# Altium project TourniquetPCBV1.PrjPcb (part 2 of 3)
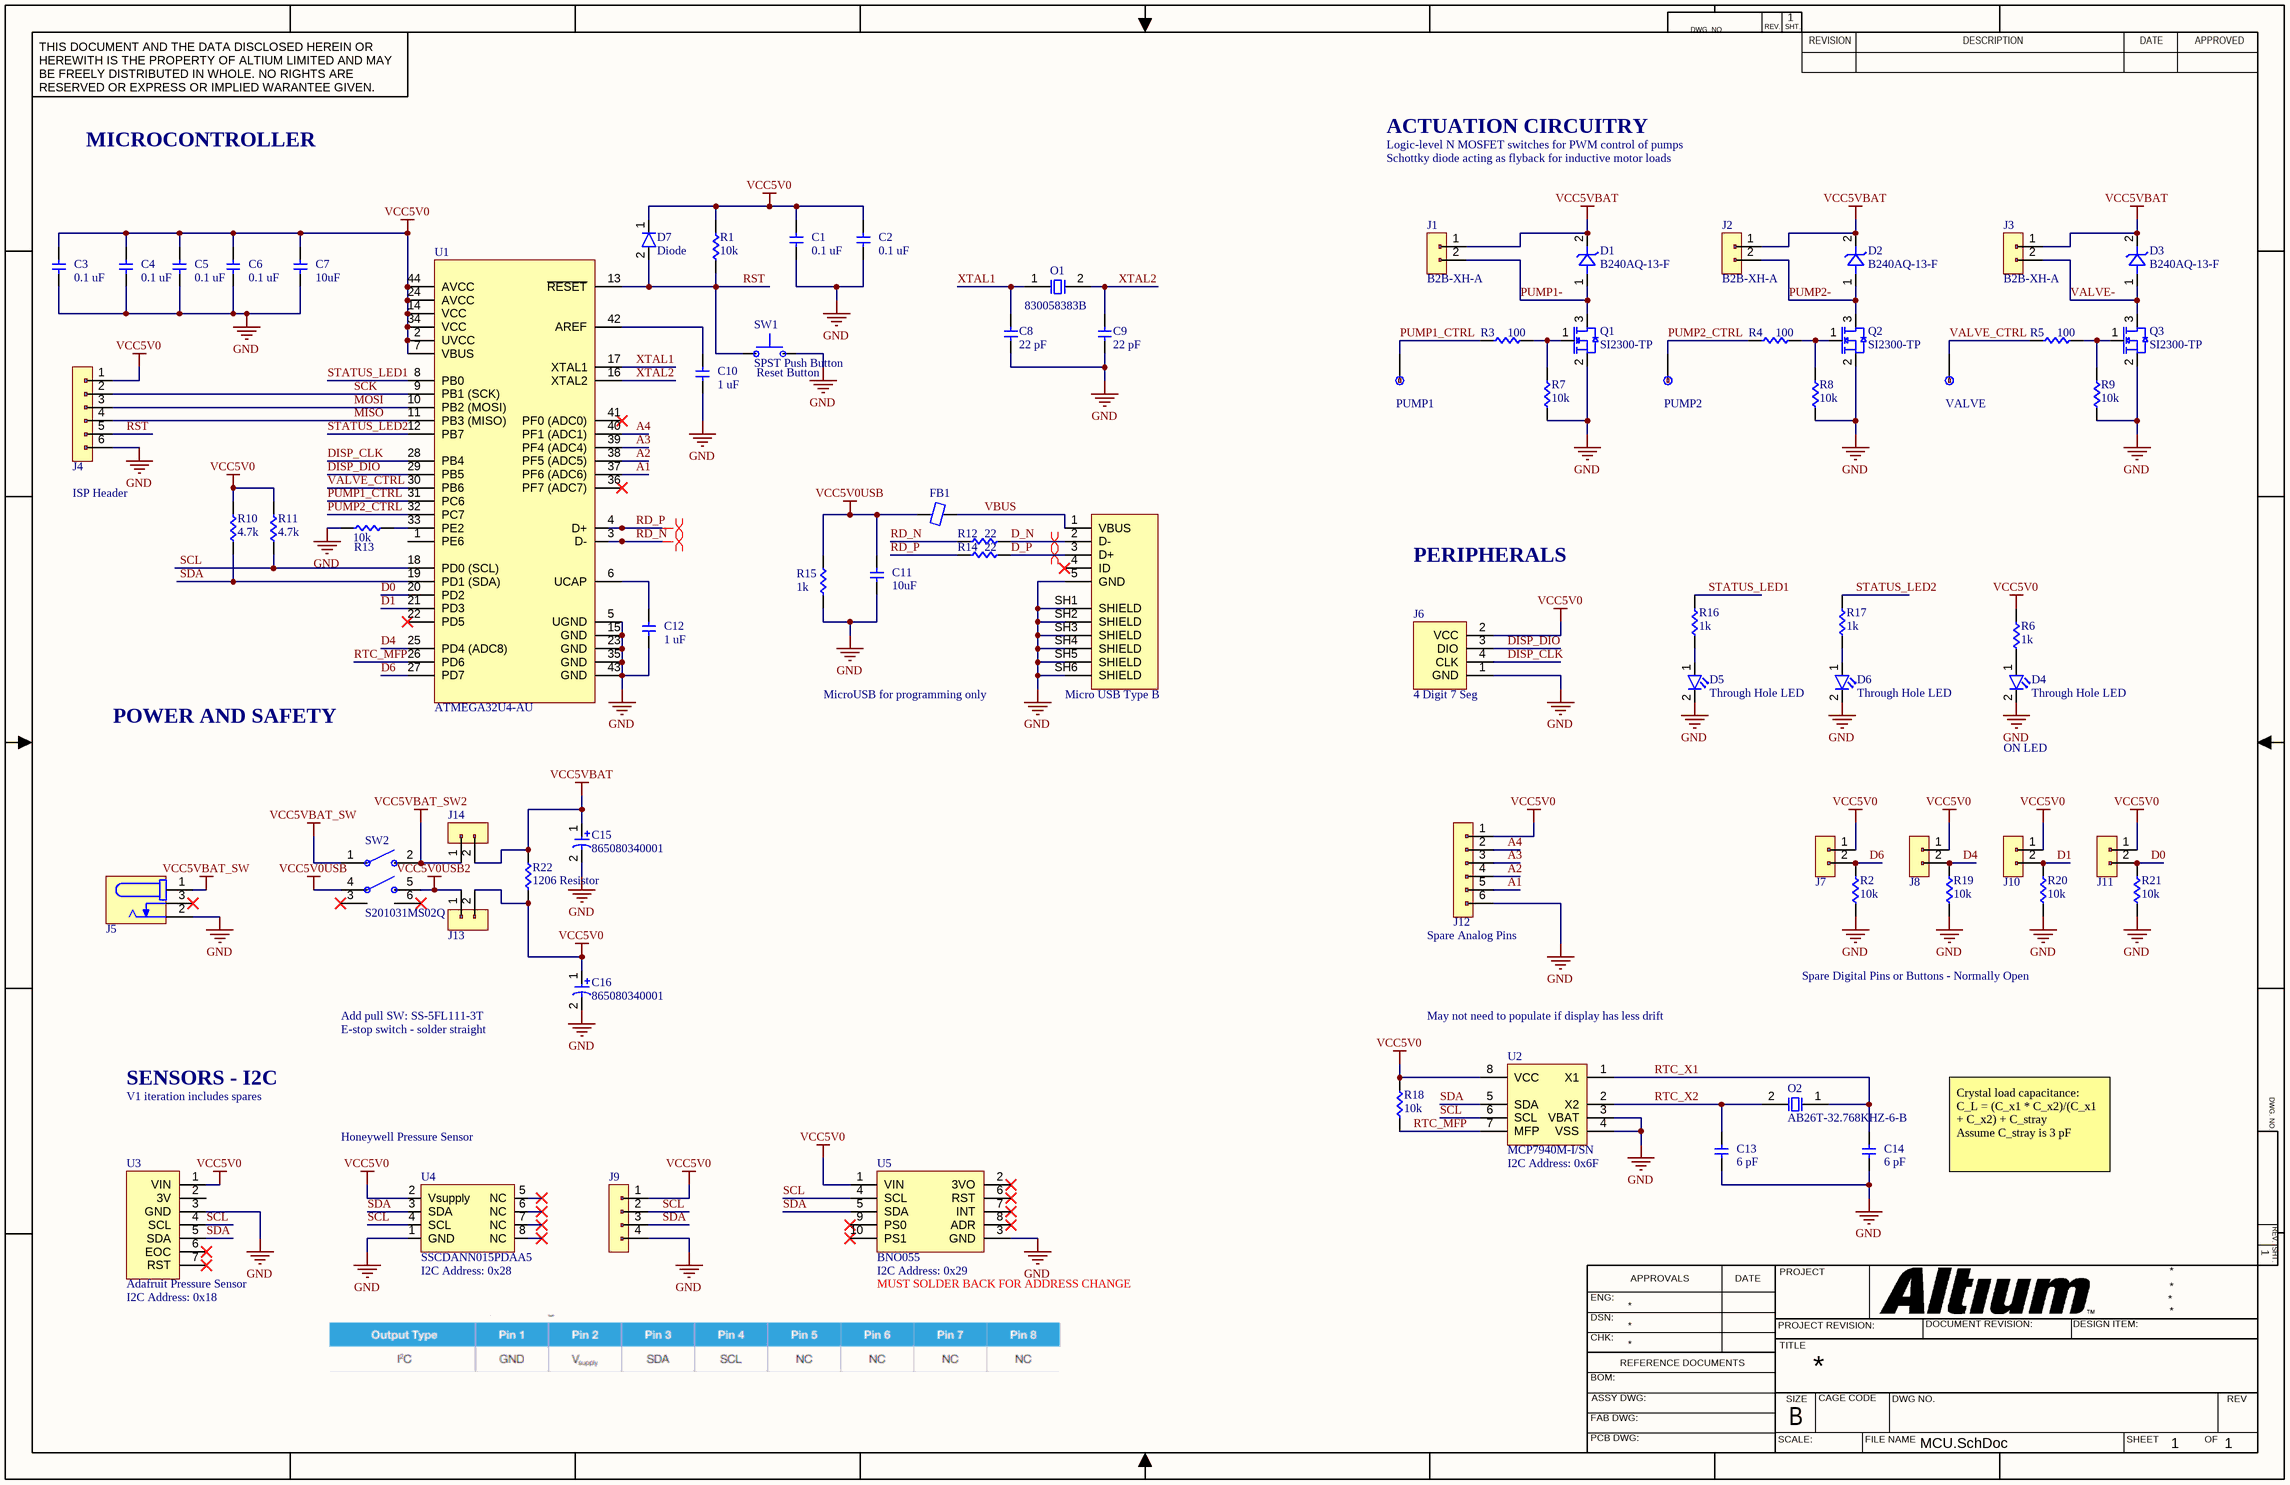
[diagram p1: MCU.SchDoc]

## Sheet MCU.SchDoc (continued)
### Library data of the parts
* = Micro USB Type B: 10118194-0001LF; Manufacturer: Molex; Manufacturer Part Number: 105164-0001; Manufacturer Lifecycle Status: ACTIVE; Current Rating: 1.8A; Dielectric Material: Liquid Crystal Polymer; Gender: Female; Max Voltage Rating (AC): 30V; Number of Circuits: 5; Number of Ports: 1; Pitch: 650µm; Plating: Gold; USB Standard: USB 2.0; Supplier: Avnet; Supplier Part Number: 1051640001; RoHS: Compliant; Category: USB Connectors; Stock: 9100; Pricing: 1300=0.47412, 16900=0.40682, 40300=0.38931, 80600=0.36143, 200200=0.329 (USD); China RoHS: Compliant; Color: Black; Connector Type: USB; Contact Gender: Female; Contact Material: Brass; Contact Plating: Gold; Country of Origin: US; Depth: 5.15mm; Flammability Rating: UL94 V-0; Halogen Free: Low Halogen; Height: 2.715mm; Housing Material: Polymer; Length: 7.5mm; Lifecycle Status: Production; Max Operating Temperature: 85°C; Min Operating Temperature: -30°C; Mounting Technology: Horizontal, Surface Mount; Number of Contacts: 5; Pins: 5; Number of Rows: 1; Number of Terminals: 5; Orientation: Right Angle; Radiation Hardening: No; REACH SVHC: Yes; Schedule B: 8536695050; Shell Material: Stainless Steel; Termination: Solder; Voltage Rating: 30V; Voltage Rating (AC): 30V; ComponentLink1URL: https://datasheet.octopart.com:443/105164-0001-Molex-datasheet-138896958.pdf?src-supplier=Upverter; ComponentLink1Description: https://datasheet.octopart.com:443/105164-0001-Molex-datasheet-138896958.pdf?src-supplier=Upverter; ComponentLink2URL: https://sigma.octopart.com:443/138896959/technical_drawing/Molex-105164-0001.pdf?src-supplier=Upverter; ComponentLink2Description: https://sigma.octopart.com:443/138896959/technical_drawing/Molex-105164-0001.pdf?src-supplier=Upverter; ComponentLink3URL: https://datasheet.octopart.com:443/105164-0001-Molex-datasheet-16324421.pdf?src-supplier=Sager+Electronics; ComponentLink3Description: https://datasheet.octopart.com:443/105164-0001-Molex-datasheet-16324421.pdf?src-supplier=Sager+Electronics; ComponentLink4URL: https://sigma.octopart.com:443/16324424/technical_drawing/Molex-105164-0001.pdf?src-supplier=Molex; ComponentLink4Description: https://sigma.octopart.com:443/16324424/technical_drawing/Molex-105164-0001.pdf?src-supplier=Molex; ComponentLink5URL: https://datasheet.octopart.com:443/105164-0001-Molex-datasheet-66419585.pdf?src-supplier=element14+APAC; ComponentLink5Description: https://datasheet.octopart.com:443/105164-0001-Molex-datasheet-66419585.pdf?src-supplier=element14+APAC; ComponentLink6URL: https://datasheet.octopart.com:443/105164-0001-Molex-datasheet-140174757.pdf?src-supplier=RS+(Formerly+Allied+Electronics); ComponentLink6Description: https://datasheet.octopart.com:443/105164-0001-Molex-datasheet-140174757.pdf?src-supplier=RS+(Formerly+Allied+Electronics); ComponentLink7URL: https://datasheet.octopart.com:443/105164-0001-Molex-datasheet-120135208.pdf?src-supplier=RS+(Formerly+Allied+Electronics); ComponentLink7Description: https://datasheet.octopart.com:443/105164-0001-Molex-datasheet-120135208.pdf?src-supplier=RS+(Formerly+Allied+Electronics); ComponentLink8URL: https://datasheet.octopart.com:443/105164-0001-Molex-datasheet-120074113.pdf?src-supplier=TME; ComponentLink8Description: https://datasheet.octopart.com:443/105164-0001-Molex-datasheet-120074113.pdf?src-supplier=TME; ComponentLink9URL: https://datasheet.octopart.com:443/105164-0001-Molex-datasheet-13747870.pdf?src-supplier=_legacy+Avnet; ComponentLink9Description: https://datasheet.octopart.com:443/105164-0001-Molex-datasheet-13747870.pdf?src-supplier=_legacy+Avnet; ComponentLink10URL: http://sigma.octopart.com:80/16324423/rohs_statement/Molex-105164-0001.pdf?src-supplier=Compliance+Statements; ComponentLink10Description: http://sigma.octopart.com:80/16324423/rohs_statement/Molex-105164-0001.pdf?src-supplier=Compliance+Statements; ComponentLink11URL: http://sigma.octopart.com:80/reach_statement/Molex-company-74.pdf?src-supplier=Compliance+Statements; ComponentLink11Description: http://sigma.octopart.com:80/reach_statement/Molex-company-74.pdf?src-supplier=Compliance+Statements; ComponentLink12URL: http://sigma.octopart.com:80/rohs_statement/Molex-company-73.pdf?src-supplier=Compliance+Statements; ComponentLink12Description: http://sigma.octopart.com:80/rohs_statement/Molex-company-73.pdf?src-supplier=Compliance+Statements; ComponentLink13URL: http://sigma.octopart.com:80/conflict_mineral_statement/Molex-company-72.pdf?src-supplier=Compliance+Statements; ComponentLink13Description: http://sigma.octopart.com:80/conflict_mineral_statement/Molex-company-72.pdf?src-supplier=Compliance+Statements
C1-C14 = CAPACITOR: 16V 100nF X7R ±10% 0603 Multilayer Ceramic Capacitors MLCC - SMD/SMT ROHS; Manufacturer: Yageo Group; Manufacturer Part Number: CC0603KRX7R7BB104; Insulation Resistance: 100GΩ; Supplier: Avnet; Supplier Part Number: CC0603KRX7R7BB104; RoHS: Compliant; Category: Ceramic Capacitors; Stock: 1252000; Pricing: 4000=0.00582, 8000=0.00559, 16000=0.00541, 32000=0.00522, 64000=0.00504 (USD); Value: 100nF; Case/Package: 0603; Case Code (Imperial): 0603; Case Code (Metric): 1608; China RoHS: Compliant; Composition: Ceramic; Depth: 800µm; Dielectric: X7R; Dielectric Material: Ceramic; Halogen Free: Halogen Free; Height: 800µm; Lead Free: Lead Free; Length: 1.6mm; Lifecycle Status: Production; Material: Ceramic; Max Operating Temperature: 125°C; Min Operating Temperature: -55°C; Mounting Technology: Surface Mount; Pins: 2; Number of Terminals: 2; Radiation Hardening: No; REACH SVHC: Yes; Schedule B: 8532240020, 8532240020|8532240020, 8532240020|8532240020|8532240020, 8532240020|8532240020|8532240020|8532240020; Termination: SMD/SMT; Thickness: 889µm; Tolerance: 10%; Voltage: 16V; Voltage Rating: 16V; Voltage Rating (DC): 16V; Width: 800µm; ComponentLink1URL: https://datasheet.octopart.com:443/CC0603KRX7R7BB104-Yageo-datasheet-177165144.pdf?src-supplier=IHS; ComponentLink1Description: https://datasheet.octopart.com:443/CC0603KRX7R7BB104-Yageo-datasheet-177165144.pdf?src-supplier=IHS; ComponentLink2URL: https://datasheet.octopart.com:443/CC0603KRX7R7BB104-Yageo-datasheet-82288757.pdf?src-supplier=Upverter; ComponentLink2Description: https://datasheet.octopart.com:443/CC0603KRX7R7BB104-Yageo-datasheet-82288757.pdf?src-supplier=Upverter; ComponentLink3URL: https://datasheet.octopart.com/CC0603KRX7R7BB104-Yageo-datasheet-10883670.pdf; ComponentLink3Description: https://datasheet.octopart.com/CC0603KRX7R7BB104-Yageo-datasheet-10883670.pdf; ComponentLink4URL: https://datasheet.octopart.com:443/CC0603KRX7R7BB104-Yageo-datasheet-181968638.pdf?src-supplier=Newark; ComponentLink4Description: https://datasheet.octopart.com:443/CC0603KRX7R7BB104-Yageo-datasheet-181968638.pdf?src-supplier=Newark; ComponentLink5URL: https://datasheet.octopart.com:443/CC0603KRX7R7BB104-Phycomp-datasheet-499490.pdf?src-supplier=Newark; ComponentLink5Description: https://datasheet.octopart.com:443/CC0603KRX7R7BB104-Phycomp-datasheet-499490.pdf?src-supplier=Newark; ComponentLink6URL: https://datasheet.octopart.com:443/CC0603KRX7R7BB104-Yageo-datasheet-62336348.pdf?src-supplier=Newark; ComponentLink6Description: https://datasheet.octopart.com:443/CC0603KRX7R7BB104-Yageo-datasheet-62336348.pdf?src-supplier=Newark; ComponentLink7URL: https://datasheet.octopart.com:443/CC0603KRX7R7BB104-Yageo-datasheet-15895757.pdf?src-supplier=Newark; ComponentLink7Description: https://datasheet.octopart.com:443/CC0603KRX7R7BB104-Yageo-datasheet-15895757.pdf?src-supplier=Newark; ComponentLink8URL: https://datasheet.octopart.com:443/CC0603KRX7R7BB104-Yageo-datasheet-182050803.pdf?src-supplier=Newark; ComponentLink8Description: https://datasheet.octopart.com:443/CC0603KRX7R7BB104-Yageo-datasheet-182050803.pdf?src-supplier=Newark; ComponentLink9URL: https://datasheet.octopart.com:443/CC0603KRX7R7BB104-Yageo-datasheet-151948686.pdf?src-supplier=Farnell; ComponentLink9Description: https://datasheet.octopart.com:443/CC0603KRX7R7BB104-Yageo-datasheet-151948686.pdf?src-supplier=Farnell; ComponentLink10URL: https://datasheet.octopart.com:443/CC0603KRX7R7BB104-Phycomp-datasheet-500777.pdf?src-supplier=Farnell; ComponentLink10Description: https://datasheet.octopart.com:443/CC0603KRX7R7BB104-Phycomp-datasheet-500777.pdf?src-supplier=Farnell; ComponentLink11URL: https://datasheet.octopart.com:443/CC0603KRX7R7BB104-Phycomp-datasheet-519481.pdf?src-supplier=element14; ComponentLink11Description: https://datasheet.octopart.com:443/CC0603KRX7R7BB104-Phycomp-datasheet-519481.pdf?src-supplier=element14; ComponentLink12URL: https://datasheet.octopart.com:443/CC0603KRX7R7BB104-Yageo-datasheet-8701427.pdf?src-supplier=element14; ComponentLink12Description: https://datasheet.octopart.com:443/CC0603KRX7R7BB104-Yageo-datasheet-8701427.pdf?src-supplier=element14; ComponentLink13URL: https://datasheet.octopart.com:443/CC0603KRX7R7BB104-Yageo-datasheet-5301394.pdf?src-supplier=element14; ComponentLink13Description: https://datasheet.octopart.com:443/CC0603KRX7R7BB104-Yageo-datasheet-5301394.pdf?src-supplier=element14; ComponentLink14URL: https://datasheet.octopart.com:443/CC0603KRX7R7BB104-Yageo-datasheet-166511530.pdf?src-supplier=Future+Electronics; ComponentLink14Description: https://datasheet.octopart.com:443/CC0603KRX7R7BB104-Yageo-datasheet-166511530.pdf?src-supplier=Future+Electronics; ComponentLink15URL: https://datasheet.octopart.com:443/CC0603KRX7R7BB104-Yageo-datasheet-137700082.pdf?src-supplier=Future+Electronics; ComponentLink15Description: https://datasheet.octopart.com:443/CC0603KRX7R7BB104-Yageo-datasheet-137700082.pdf?src-supplier=Future+Electronics; ComponentLink16URL: https://datasheet.octopart.com:443/CC0603KRX7R7BB104-Yageo-datasheet-137700084.pdf?src-supplier=Future+Electronics; ComponentLink16Description: https://datasheet.octopart.com:443/CC0603KRX7R7BB104-Yageo-datasheet-137700084.pdf?src-supplier=Future+Electronics; ComponentLink17URL: https://datasheet.octopart.com:443/CC0603KRX7R7BB104-Yageo-datasheet-27626582.pdf?src-supplier=Future+Electronics; ComponentLink17Description: https://datasheet.octopart.com:443/CC0603KRX7R7BB104-Yageo-datasheet-27626582.pdf?src-supplier=Future+Electronics; ComponentLink18URL: https://datasheet.octopart.com:443/CC0603KRX7R7BB104-Yageo-datasheet-12526321.pdf?src-supplier=Future+Electronics; ComponentLink18Description: https://datasheet.octopart.com:443/CC0603KRX7R7BB104-Yageo-datasheet-12526321.pdf?src-supplier=Future+Electronics; ComponentLink19URL: https://datasheet.octopart.com:443/CC0603KRX7R7BB104-Yageo-datasheet-10911834.pdf?src-supplier=Future+Electronics; ComponentLink19Description: https://datasheet.octopart.com:443/CC0603KRX7R7BB104-Yageo-datasheet-10911834.pdf?src-supplier=Future+Electronics; ComponentLink20URL: https://datasheet.octopart.com:443/CC0603KRX7R7BB104-Yageo-datasheet-8324442.pdf?src-supplier=Future+Electronics; ComponentLink20Description: https://datasheet.octopart.com:443/CC0603KRX7R7BB104-Yageo-datasheet-8324442.pdf?src-supplier=Future+Electronics; ComponentLink21URL: https://datasheet.octopart.com:443/CC0603KRX7R7BB104-Yageo-Group-datasheet-165992755.pdf?src-supplier=ODG+(Origin+Data+Global); ComponentLink21Description: https://datasheet.octopart.com:443/CC0603KRX7R7BB104-Yageo-Group-datasheet-165992755.pdf?src-supplier=ODG+(Origin+Data+Global); ComponentLink22URL: https://datasheet.octopart.com:443/CC0603KRX7R7BB104-Yageo-datasheet-140260305.pdf?src-supplier=SOS+electronic; ComponentLink22Description: https://datasheet.octopart.com:443/CC0603KRX7R7BB104-Yageo-datasheet-140260305.pdf?src-supplier=SOS+electronic; ComponentLink23URL: https://datasheet.octopart.com:443/CC0603KRX7R7BB104-Yageo-datasheet-178018956.pdf?src-supplier=Burklin+Elektronik; ComponentLink23Description: https://datasheet.octopart.com:443/CC0603KRX7R7BB104-Yageo-datasheet-178018956.pdf?src-supplier=Burklin+Elektronik; ComponentLink24URL: https://datasheet.octopart.com:443/CC0603KRX7R7BB104-Yageo-datasheet-17600895.pdf?src-supplier=TME; ComponentLink24Description: https://datasheet.octopart.com:443/CC0603KRX7R7BB104-Yageo-datasheet-17600895.pdf?src-supplier=TME; ComponentLink25URL: https://datasheet.octopart.com:443/CC0603KRX7R7BB104-Yageo-datasheet-118396.pdf?src-supplier=DigiKey; ComponentLink25Description: https://datasheet.octopart.com:443/CC0603KRX7R7BB104-Yageo-datasheet-118396.pdf?src-supplier=DigiKey; ComponentLink26URL: http://sigma.octopart.com:80/conflict_mineral_statement/Yageo-company-3.pdf?src-supplier=Compliance+Statements; ComponentLink26Description: http://sigma.octopart.com:80/conflict_mineral_statement/Yageo-company-3.pdf?src-supplier=Compliance+Statements; ComponentLink27URL: http://sigma.octopart.com:80/rohs_statement/Yageo-company-2.pdf?src-supplier=Compliance+Statements; ComponentLink27Description: http://sigma.octopart.com:80/rohs_statement/Yageo-company-2.pdf?src-supplier=Compliance+Statements
C15 C16 = CAP_POLARIZED: 10 µF 16 V Aluminum Electrolytic Capacitors Radial, Can - SMD 2000 Hrs @ 105°C; Manufacturer: Wurth; Manufacturer Part Number: 0878310641; Number of Positions: 6; Current Rating: 2A; Voltage Rating: 125V; Gender: Male; Reviewed: No; Part Number: 865080340001; Series: Milli-Grid 87831; Mount: Through Hole; Number of Rows: 2; Fastening Type: Latch Holder; Orientation: Vertical; Min Operating Temperature: -55°C; Max Operating Temperature: 105°C; Supplier 1: Digi-Key; Supplier Part Number 1: WM3590-ND; ComponentLink1URL: https://tools.molex.com/pdm_docs/ps/PS-87831-027.pdf; ComponentLink1Description: Datasheet
D1-D3 = SCHOTTKY: Manufacturer: Diodes Incorporated; Current Rating: 2A; Voltage Rating: 40; Reviewed: No; Part Number: B240AQ-13-F; Manufacturer Part Number: B240AQ-13-F; Series: -; Mount: Surface; Supplier Part Number 1: WM3590-ND; ComponentLink1URL: https://tools.molex.com/pdm_docs/ps/PS-87831-027.pdf; ComponentLink1Description: Datasheet
D4-D6 = LED RED DIFFUSED 5MM ROUND T/H: Red 645nm LED Indication - Discrete 2.1V Radial; Manufacturer: Wurth Elektronik; Manufacturer Part Number: 151051RS11000; Forward Current: 100mA; Lens Size: 5mm; Lens Style: Circular, Diffused, Round; Luminous Intensity: 30mcd; Max Reverse Voltage (DC): 5V; Peak Wavelength: 650nm; Test Current: 20mA; Viewing Angle: 60°; Wavelength: 630nm; Supplier: Newark; Supplier Part Number: 151051RS11000; RoHS: Compliant; Category: LEDs; Stock: 1883; Pricing: 5=0.269, 10=0.262, 25=0.255, 50=0.248, 100=0.217, 500=0.201 (CAD); Case/Package: Radial; Color: Red; Dominant Wavelength: 645nm; Forward Voltage: 2.1V; Height: 8.6mm; Length: 5mm; Max Operating Temperature: 85°C; Min Operating Temperature: -40°C; Mounting Technology: Through Hole; Packaging: Bulk; REACH SVHC: Unknown; Width: 5mm; ComponentLink1URL: https://datasheet.octopart.com:443/151051RS11000-Wurth-Elektronik-datasheet-168474692.pdf?src-supplier=Wurth+Elektronik; ComponentLink1Description: https://datasheet.octopart.com:443/151051RS11000-Wurth-Elektronik-datasheet-168474692.pdf?src-supplier=Wurth+Elektronik; ComponentLink2URL: https://datasheet.octopart.com:443/151051RS11000-W%C3%BCrth-Elektronik-datasheet-83005830.pdf?src-supplier=Future+Electronics; ComponentLink2Description: https://datasheet.octopart.com:443/151051RS11000-W%C3%BCrth-Elektronik-datasheet-83005830.pdf?src-supplier=Future+Electronics; ComponentLink3URL: https://datasheet.octopart.com:443/151051RS11000-W%C3%BCrth-Elektronik-datasheet-15983824.pdf?src-supplier=element14+APAC; ComponentLink3Description: https://datasheet.octopart.com:443/151051RS11000-W%C3%BCrth-Elektronik-datasheet-15983824.pdf?src-supplier=element14+APAC
D7 = Diode: Diode 100 V 150mA Surface Mount SOD-123; Manufacturer: onsemi; Manufacturer Part Number: 1N4148WS; Manufacturer Lifecycle Status: ACTIVE; Value: 4pF; Element Configuration: Single; Forward Voltage: 1V; Max Forward Surge Current (Ifsm): 4A; Max Junction Temperature (Tj): 150°C; Max Power Dissipation: 200mW; Max Repetitive Reverse Voltage (Vrrm): 75V; Number of Elements: 1; Peak Reverse Current: 5µA; Recovery Time: 4ns; Supplier: Avnet; Supplier Part Number: 1N4148WS; RoHS: Compliant; Category: Rectifier Diodes; Stock: 171000; Pricing: 3000=0.01888, 6000=0.01822, 12000=0.01795, 24000=0.01769, 48000=0.01742 (USD); Average Rectified Current: 150mA; China RoHS: Compliant; Contact Plating: Tin; Forward Current: 150mA; Height: 900µm; Lead Free: Lead Free; Length: 1.8mm; Lifecycle Status: Production; Max Operating Temperature: 150°C; Max Output current: 150mA; Max Reverse Voltage (DC): 75V; Min Operating Temperature: -55°C; Mounting Technology: Surface Mount; Pins: 2; Number of Terminals: 2; Packaging: Cut Tape; Power Dissipation: 200mW; Radiation Hardening: No; REACH SVHC: Yes; Reverse Recovery Time: 4ns; Reverse Standoff Voltage: 75V; Reverse Voltage: 75V; Schedule B: 8541100070, 8541100070|8541100070|8541100070|8541100070|8541100070|8541100070|8541100070|8541100070|8541100070|8541100070|8541100070|8541100070|8541100070|8541100070|8541100070|8541100070|8541100070|8541100070|8541100070|8541100070|8541100070|8541100070|8541100070|85; Weight: 27.6mg; Width: 1.35mm; ComponentLink1URL: https://datasheet.octopart.com:443/1N4148WS-ON-Semiconductor-datasheet-154551630.pdf?src-supplier=Farnell; ComponentLink1Description: https://datasheet.octopart.com:443/1N4148WS-ON-Semiconductor-datasheet-154551630.pdf?src-supplier=Farnell; ComponentLink2URL: https://datasheet.octopart.com:443/1N4148WS-Fairchild-Semiconductor-datasheet-67878664.pdf?src-supplier=Farnell; ComponentLink2Description: https://datasheet.octopart.com:443/1N4148WS-Fairchild-Semiconductor-datasheet-67878664.pdf?src-supplier=Farnell; ComponentLink3URL: https://datasheet.octopart.com:443/1N4148WS-Fairchild-Semiconductor-datasheet-68650011.pdf?src-supplier=Farnell; ComponentLink3Description: https://datasheet.octopart.com:443/1N4148WS-Fairchild-Semiconductor-datasheet-68650011.pdf?src-supplier=Farnell; ComponentLink4URL: https://datasheet.octopart.com:443/1N4148WS-ON-Semiconductor-datasheet-11741836.pdf?src-supplier=Upverter; ComponentLink4Description: https://datasheet.octopart.com:443/1N4148WS-ON-Semiconductor-datasheet-11741836.pdf?src-supplier=Upverter; ComponentLink5URL: https://datasheet.octopart.com:443/1N4148WS-ON-Semiconductor-datasheet-137236190.pdf?src-supplier=Upverter; ComponentLink5Description: https://datasheet.octopart.com:443/1N4148WS-ON-Semiconductor-datasheet-137236190.pdf?src-supplier=Upverter; ComponentLink6URL: https://sigma.octopart.com:443/138895951/technical_drawing/ON-Semiconductor-1N4148WS.pdf?src-supplier=Upverter; ComponentLink6Description: https://sigma.octopart.com:443/138895951/technical_drawing/ON-Semiconductor-1N4148WS.pdf?src-supplier=Upverter; ComponentLink7URL: https://datasheet.octopart.com:443/1N4148WS-ON-Semiconductor-datasheet-41168538.pdf?src-supplier=IHS; ComponentLink7Description: https://datasheet.octopart.com:443/1N4148WS-ON-Semiconductor-datasheet-41168538.pdf?src-supplier=IHS; ComponentLink8URL: https://datasheet.octopart.com:443/1N4148WS-onsemi-datasheet-175423434.pdf?src-supplier=IHS; ComponentLink8Description: https://datasheet.octopart.com:443/1N4148WS-onsemi-datasheet-175423434.pdf?src-supplier=IHS; ComponentLink9URL: https://datasheet.octopart.com:443/1N4148WS-onsemi-datasheet-181265883.pdf?src-supplier=IHS; ComponentLink9Description: https://datasheet.octopart.com:443/1N4148WS-onsemi-datasheet-181265883.pdf?src-supplier=IHS; ComponentLink10URL: https://datasheet.octopart.com:443/1N4148WS-ON-Semiconductor-datasheet-85393213.pdf?src-supplier=onsemi; ComponentLink10Description: https://datasheet.octopart.com:443/1N4148WS-ON-Semiconductor-datasheet-85393213.pdf?src-supplier=onsemi; ComponentLink11URL: https://datasheet.octopart.com:443/1N4148WS-ON-Semiconductor-datasheet-86684483.pdf?src-supplier=onsemi; ComponentLink11Description: https://datasheet.octopart.com:443/1N4148WS-ON-Semiconductor-datasheet-86684483.pdf?src-supplier=onsemi; ComponentLink12URL: https://datasheet.octopart.com:443/1N4148WS-ON-Semiconductor-datasheet-86681927.pdf?src-supplier=element14+APAC; ComponentLink12Description: https://datasheet.octopart.com:443/1N4148WS-ON-Semiconductor-datasheet-86681927.pdf?src-supplier=element14+APAC; ComponentLink13URL: https://datasheet.octopart.com:443/1N4148WS-Fairchild-datasheet-514620.pdf?src-supplier=Fairchild+Semiconductor; ComponentLink13Description: https://datasheet.octopart.com:443/1N4148WS-Fairchild-datasheet-514620.pdf?src-supplier=Fairchild+Semiconductor; ComponentLink14URL: https://sigma.octopart.com:443/17343424/technical_drawing/Fairchild-Semiconductor-1N4148WS.pdf?src-supplier=Fairchild+Semiconductor; ComponentLink14Description: https://sigma.octopart.com:443/17343424/technical_drawing/Fairchild-Semiconductor-1N4148WS.pdf?src-supplier=Fairchild+Semiconductor; ComponentLink15URL: https://datasheet.octopart.com:443/1N4148WS-Fairchild-Semiconductor-datasheet-14041777.pdf?src-supplier=iiiC; ComponentLink15Description: https://datasheet.octopart.com:443/1N4148WS-Fairchild-Semiconductor-datasheet-14041777.pdf?src-supplier=iiiC; ComponentLink16URL: https://datasheet.octopart.com:443/1N4148WS-Fairchild-Semiconductor-datasheet-67909704.pdf?src-supplier=Newark; ComponentLink16Description: https://datasheet.octopart.com:443/1N4148WS-Fairchild-Semiconductor-datasheet-67909704.pdf?src-supplier=Newark; ComponentLink17URL: https://datasheet.octopart.com:443/1N4148WS-Fairchild-Semiconductor-datasheet-68364970.pdf?src-supplier=Newark; ComponentLink17Description: https://datasheet.octopart.com:443/1N4148WS-Fairchild-Semiconductor-datasheet-68364970.pdf?src-supplier=Newark; ComponentLink18URL: http://sigma.octopart.com:80/150599222/rohs_statement/ON-Semiconductor-1N4148WS.pdf?src-supplier=Compliance+Statements; ComponentLink18Description: http://sigma.octopart.com:80/150599222/rohs_statement/ON-Semiconductor-1N4148WS.pdf?src-supplier=Compliance+Statements; ComponentLink19URL: http://sigma.octopart.com:80/17343422/reach_statement/Fairchild-Semiconductor-1N4148WS.pdf?src-supplier=Compliance+Statements; ComponentLink19Description: http://sigma.octopart.com:80/17343422/reach_statement/Fairchild-Semiconductor-1N4148WS.pdf?src-supplier=Compliance+Statements; ComponentLink20URL: http://sigma.octopart.com:80/17343423/materials_sheet/Fairchild-Semiconductor-1N4148WS.pdf?src-supplier=Compliance+Statements; ComponentLink20Description: http://sigma.octopart.com:80/17343423/materials_sheet/Fairchild-Semiconductor-1N4148WS.pdf?src-supplier=Compliance+Statements; ComponentLink21URL: http://sigma.octopart.com:80/33026183/reach_statement/Fairchild-Semiconductor-1N4148WS.pdf?src-supplier=Compliance+Statements; ComponentLink21Description: http://sigma.octopart.com:80/33026183/reach_statement/Fairchild-Semiconductor-1N4148WS.pdf?src-supplier=Compliance+Statements; ComponentLink22URL: http://sigma.octopart.com:80/33026185/materials_sheet/Fairchild-Semiconductor-1N4148WS.pdf?src-supplier=Compliance+Statements; ComponentLink22Description: http://sigma.octopart.com:80/33026185/materials_sheet/Fairchild-Semiconductor-1N4148WS.pdf?src-supplier=Compliance+Statements; ComponentLink23URL: http://sigma.octopart.com:80/reach_statement/ON-Semiconductor-company-79.pdf?src-supplier=Compliance+Statements; ComponentLink23Description: http://sigma.octopart.com:80/reach_statement/ON-Semiconductor-company-79.pdf?src-supplier=Compliance+Statements; ComponentLink24URL: http://sigma.octopart.com:80/rohs_statement/Fairchild-Semiconductor-company-11.pdf?src-supplier=Compliance+Statements; ComponentLink24Description: http://sigma.octopart.com:80/rohs_statement/Fairchild-Semiconductor-company-11.pdf?src-supplier=Compliance+Statements; ComponentLink25URL: http://sigma.octopart.com:80/rohs_statement/Fairchild-Semiconductor-company-10.pdf?src-supplier=Compliance+Statements; ComponentLink25Description: http://sigma.octopart.com:80/rohs_statement/Fairchild-Semiconductor-company-10.pdf?src-supplier=Compliance+Statements; ComponentLink26URL: http://sigma.octopart.com:80/reach_statement/Fairchild-Semiconductor-company-9.pdf?src-supplier=Compliance+Statements; ComponentLink26Description: http://sigma.octopart.com:80/reach_statement/Fairchild-Semiconductor-company-9.pdf?src-supplier=Compliance+Statements; ComponentLink27URL: https://octopart.com:443/opatz8j6/c1?t=uHNM4vEE5RF4Wag2R8kp6VlT4pqZhBeJnwFOwXCl1LdBIS0OfKt6iLU6zSwumjeV84ZoVx-BohKOdz8WxXol_lFRhccKbbirABoiNNEUOoiiHpLvrlnaqw6ivq0fNiOAwmbnwS_wu4a_bpVA6OlhtCLPYRSnKrIi2lsKLrM-59zupe5GdMDxNcDcvexuQu623eH8JwKLKAOtVvsRb9B5uh7SaBNx-mVh-99rNoWwC-t1ZI7kNy9N7MQnwsOnwV2wEnePMA_8VNOs7YOCSySFX_D5sQjssxvPaJMzGX3Fu5hAYAWH6C6RGVn2R7L8ham7Ii6Y7W0JBgvKChIBqfSyj4KKD9x85vg38LCZ&src-supplier=Compliance+Statements; ComponentLink27Description: https://octopart.com:443/opatz8j6/c1?t=uHNM4vEE5RF4Wag2R8kp6VlT4pqZhBeJnwFOwXCl1LdBIS0OfKt6iLU6zSwumjeV84ZoVx-BohKOdz8WxXol_lFRhccKbbirABoiNNEUOoiiHpLvrlnaqw6ivq0fNiOAwmbnwS_wu4a_bpVA6OlhtCLPYRSnKrIi2lsKLrM-59zupe5GdMDxNcDcvexuQu623eH8JwKLKAOtVvsRb9B5uh7SaBNx-mVh-99rNoWwC-t1ZI7kNy9N7MQnwsOnwV2wEnePMA_8VNOs7YOCSySFX_D5sQjssxvPaJMzGX3Fu5hAYAWH6C6RGVn2R7L8ham7Ii6Y7W0JBgvKChIBqfSyj4KKD9x85vg38LCZ&src-supplier=Compliance+Statements; ComponentLink28URL: https://octopart.com:443/opatz8j6/c1?t=JoVNp00jKFgAwlYcNpqrHNBvQdEgXnvd9TtzPlbpkuwn1q6IGg3foLc9dMjek33MGok0_F9d8-FklcBG_3-NN3HiNPj-kIq-kDcMbF-5G_YGsbIpjuyZJMIeAynYQr8ACdD7CYDv5pcWsenCztYc-VaJWKdxwlJUKaNsU8AAFB64gurg-TyIZkyutiLJlTN7a9uopgYHLR-wf0BKqemv6J5tGI6NWqyR1yTTVq2bu8gDDCjNmn8cXihQjkrKXmsKdX0UxqSCrQoxvuBozyVXOHg47yfoLsXgcrCe8i61tiXk82lhNmjIF86wLJ1dVeH3LjIwj5NhzpWWIrfWgcJvgwRxNIZIgYQ13nuGCQ&src-supplier=Compliance+Statements; ComponentLink28Description: https://octopart.com:443/opatz8j6/c1?t=JoVNp00jKFgAwlYcNpqrHNBvQdEgXnvd9TtzPlbpkuwn1q6IGg3foLc9dMjek33MGok0_F9d8-FklcBG_3-NN3HiNPj-kIq-kDcMbF-5G_YGsbIpjuyZJMIeAynYQr8ACdD7CYDv5pcWsenCztYc-VaJWKdxwlJUKaNsU8AAFB64gurg-TyIZkyutiLJlTN7a9uopgYHLR-wf0BKqemv6J5tGI6NWqyR1yTTVq2bu8gDDCjNmn8cXihQjkrKXmsKdX0UxqSCrQoxvuBozyVXOHg47yfoLsXgcrCe8i61tiXk82lhNmjIF86wLJ1dVeH3LjIwj5NhzpWWIrfWgcJvgwRxNIZIgYQ13nuGCQ&src-supplier=Compliance+Statements
FB1 = Ferrite Bead 732-1591-2-ND: 30 Ohms @ 100 MHz 1 Signal Line Ferrite Bead 0603 (1608 Metric) 3A 40mOhm; Manufacturer: KEMET; Manufacturer Part Number: C0805F104K4RACTU; Value: 100nF; Dielectric: X7R; Dielectric Material: Ceramic; Tolerance: 10%; Voltage Rating: 16V; Supplier: Newark; Supplier Part Number: C0805F104K4RACTU; RoHS: Compliant; Category: Ceramic Capacitors; Stock: 2981; Pricing: 10=0.244 (CAD); Case/Package: 0805; Case Code (Imperial): 0805; Case Code (Metric): 2012; China RoHS: Compliant; Features: Soft Termination; Height: 1.25mm; Length: 2mm; Lifecycle Status: Production; Max Operating Temperature: 125°C; Min Operating Temperature: -55°C; Mounting Technology: Surface Mount; Number of Terminals: 2; REACH SVHC: Yes; Termination: SMD/SMT; Thickness: 1.397mm; Voltage Rating (DC): 16V; Weight: 5.499807mg; Width: 1.25mm; ComponentLink1URL: https://datasheet.octopart.com:443/C0805F104K4RACTU-KEMET-datasheet-178087927.pdf?src-supplier=IHS; ComponentLink1Description: https://datasheet.octopart.com:443/C0805F104K4RACTU-KEMET-datasheet-178087927.pdf?src-supplier=IHS; ComponentLink2URL: https://datasheet.octopart.com/C0805F104K4RACTU-KEMET-datasheet-84169754.pdf; ComponentLink2Description: https://datasheet.octopart.com/C0805F104K4RACTU-KEMET-datasheet-84169754.pdf
J1-J3 = B2B-XH-A: Two Pin JST XH Header; Manufacturer: Samtec; Manufacturer Part Number: TSM-102-01-L-SV; Manufacturer Lifecycle Status: PRODUCTION; Connector Type: Male Pin; Current Rating: 7A; Gender: Male; Max Voltage Rating (AC): 475V; Number of Contacts: 2; Pitch: 2.54mm; Supplier: Newark; Supplier Part Number: TSM-102-01-L-SV; RoHS: Compliant; Category: Headers and Wire Housings; Stock: 5152; Pricing: 1=0.42, 250=0.355, 1000=0.302, 5000=0.249, 10000=0.198 (CAD); Color: Black; Contact Material: Bronze; Contact Mating Length: 5.842mm; Contact Plating: Gold; Depth: 2.54mm; Housing Color: Black; Housing Material: Polymer; Lead Free: Lead Free; Length: 5.08mm; Lifecycle Status: Production; Max Current Rating: 7A; Max Operating Temperature: 125°C; Min Operating Temperature: -55°C; Mounting Technology: Surface Mount; Pins: 2; Number of Positions: 2; Number of Rows: 1; Radiation Hardening: No; REACH SVHC: No; Termination: Solder; Voltage Rating: 475V; ComponentLink1URL: https://datasheet.octopart.com:443/TSM-102-01-L-SV-Samtec-datasheet-141160580.pdf?src-supplier=Master+Electronics; ComponentLink1Description: https://datasheet.octopart.com:443/TSM-102-01-L-SV-Samtec-datasheet-141160580.pdf?src-supplier=Master+Electronics; ComponentLink2URL: https://datasheet.octopart.com:443/TSM-102-01-L-SV-Samtec-datasheet-97319594.pdf?src-supplier=Sager+Electronics; ComponentLink2Description: https://datasheet.octopart.com:443/TSM-102-01-L-SV-Samtec-datasheet-97319594.pdf?src-supplier=Sager+Electronics; ComponentLink3URL: https://datasheet.octopart.com:443/TSM-102-01-L-SV-Samtec-datasheet-155753699.pdf?src-supplier=Sager+Electronics; ComponentLink3Description: https://datasheet.octopart.com:443/TSM-102-01-L-SV-Samtec-datasheet-155753699.pdf?src-supplier=Sager+Electronics; ComponentLink4URL: https://datasheet.octopart.com:443/TSM-102-01-L-SV-Samtec-datasheet-151555687.pdf?src-supplier=Sager+Electronics; ComponentLink4Description: https://datasheet.octopart.com:443/TSM-102-01-L-SV-Samtec-datasheet-151555687.pdf?src-supplier=Sager+Electronics; ComponentLink5URL: https://sigma.octopart.com:443/141446549/technical_drawing/Samtec-TSM-102-01-L-SV.pdf?src-supplier=Samtec; ComponentLink5Description: https://sigma.octopart.com:443/141446549/technical_drawing/Samtec-TSM-102-01-L-SV.pdf?src-supplier=Samtec; ComponentLink6URL: https://sigma.octopart.com:443/97319600/technical_drawing/Samtec-TSM-102-01-L-SV.pdf?src-supplier=Samtec; ComponentLink6Description: https://sigma.octopart.com:443/97319600/technical_drawing/Samtec-TSM-102-01-L-SV.pdf?src-supplier=Samtec; ComponentLink7URL: https://datasheet.octopart.com:443/TSM-102-01-L-SV-Samtec-datasheet-68527555.pdf?src-supplier=Farnell; ComponentLink7Description: https://datasheet.octopart.com:443/TSM-102-01-L-SV-Samtec-datasheet-68527555.pdf?src-supplier=Farnell; ComponentLink8URL: https://datasheet.octopart.com:443/TSM-102-01-L-SV-Samtec-datasheet-31667586.pdf?src-supplier=Farnell; ComponentLink8Description: https://datasheet.octopart.com:443/TSM-102-01-L-SV-Samtec-datasheet-31667586.pdf?src-supplier=Farnell; ComponentLink9URL: https://datasheet.octopart.com:443/TSM-102-01-L-SV-Samtec-datasheet-41643181.pdf?src-supplier=element14+APAC; ComponentLink9Description: https://datasheet.octopart.com:443/TSM-102-01-L-SV-Samtec-datasheet-41643181.pdf?src-supplier=element14+APAC; ComponentLink10URL: https://datasheet.octopart.com:443/TSM-102-01-L-SV-Samtec-datasheet-179063997.pdf?src-supplier=JRH+Electronics; ComponentLink10Description: https://datasheet.octopart.com:443/TSM-102-01-L-SV-Samtec-datasheet-179063997.pdf?src-supplier=JRH+Electronics; ComponentLink11URL: https://datasheet.octopart.com:443/TSM-102-01-L-SV-Samtec-datasheet-116533474.pdf?src-supplier=Toby+Electronics; ComponentLink11Description: https://datasheet.octopart.com:443/TSM-102-01-L-SV-Samtec-datasheet-116533474.pdf?src-supplier=Toby+Electronics; ComponentLink12URL: https://datasheet.octopart.com:443/TSM-102-01-L-SV-Samtec-datasheet-21214708.pdf?src-supplier=Newark; ComponentLink12Description: https://datasheet.octopart.com:443/TSM-102-01-L-SV-Samtec-datasheet-21214708.pdf?src-supplier=Newark
J4 J12 = 6PIN_HEADER: Part Number: 0878310641; Manufacturer: Molex; Number of Positions: 6; Current Rating: 2A; Voltage Rating: 125V; Gender: Male; Reviewed: No; Manufacturer Part Number: 0878310641; Series: Milli-Grid 87831; Mount: Through Hole; Number of Rows: 2; Fastening Type: Latch Holder; Orientation: Vertical; Min Operating Temperature: -55°C; Max Operating Temperature: 105°C; Supplier 1: Digi-Key; Supplier Part Number 1: WM3590-ND; ComponentLink1URL: https://tools.molex.com/pdm_docs/ps/PS-87831-027.pdf; ComponentLink1Description: Datasheet
J5 = 54-00166: Barrel Jack; Manufacturer: Molex; Number of Positions: 6; Current Rating: 2A; Voltage Rating: 125V; Gender: Male; Reviewed: No; Part Number: 0878310641; Manufacturer Part Number: 0878310641; Series: Milli-Grid 87831; Mount: Through Hole; Number of Rows: 2; Fastening Type: Latch Holder; Orientation: Vertical; Min Operating Temperature: -55°C; Max Operating Temperature: 105°C; Supplier 1: Digi-Key; Supplier Part Number 1: WM3590-ND; ComponentLink1URL: https://tools.molex.com/pdm_docs/ps/PS-87831-027.pdf; ComponentLink1Description: Datasheet
J6 = 4 Digit 7 Seg 1x4 Female Header: Board Connector, 4 Contact(s), 1 Row(s), Female, Straight, 0.1 inch Pitch, Surface Mount Terminal, Locking; Manufacturer: Sullins; Manufacturer Part Number: NPTC041KFXC-RC; Connector Type: Header, Socket; Current Rating: 3A; Dielectric Material: Polyamide; Number of Positions: 4; Pitch: 2.54mm; Supplier: DigiKey; Supplier Part Number: S5596-ND; RoHS: Compliant; Category: Card Edge Connectors; Stock: 44539; Pricing: 1=0.57, 58=0.43086, 116=0.41026, 522=0.36887, 1044=0.35125, 5046=0.31428, 10034=0.30044 (USD); Color: Black; Contact Gender: Female; Contact Material: Bronze; Contact Plating: Tin; Height: 7.1mm; Housing Color: Black; Housing Material: Nylon; Lead Free: Lead Free; Length: 10.2mm; Lifecycle Status: Production; Mounting Technology: Surface Mount; Pins: 4; Number of Rows: 2; Packaging: Bulk; REACH SVHC: Yes; Terminal Pitch: 5.08mm; Termination: Solder; Width: 2.5mm; ComponentLink1URL: https://datasheet.octopart.com:443/NPTC041KFXC-RC-Sullins-datasheet-138810743.pdf?src-supplier=IHS; ComponentLink1Description: https://datasheet.octopart.com:443/NPTC041KFXC-RC-Sullins-datasheet-138810743.pdf?src-supplier=IHS; ComponentLink2URL: https://datasheet.octopart.com:443/NPTC041KFXC-RC-Sullins-datasheet-41308905.pdf?src-supplier=Future+Electronics; ComponentLink2Description: https://datasheet.octopart.com:443/NPTC041KFXC-RC-Sullins-datasheet-41308905.pdf?src-supplier=Future+Electronics; ComponentLink3URL: https://datasheet.octopart.com:443/NPTC041KFXC-RC-Sullins-datasheet-120059.pdf?src-supplier=DigiKey; ComponentLink3Description: https://datasheet.octopart.com:443/NPTC041KFXC-RC-Sullins-datasheet-120059.pdf?src-supplier=DigiKey
J7 J8 J10 J11 J13 J14 = 2PIN_HEADER: 2PIN; Manufacturer: Molex; Number of Positions: 6; Current Rating: 2A; Voltage Rating: 125V; Gender: Male; Reviewed: No; Part Number: 0878310641; Manufacturer Part Number: 0878310641; Series: Milli-Grid 87831; Mount: Through Hole; Number of Rows: 2; Fastening Type: Latch Holder; Orientation: Vertical; Min Operating Temperature: -55°C; Max Operating Temperature: 105°C; Supplier 1: Digi-Key; Supplier Part Number 1: WM3590-ND; ComponentLink1URL: https://tools.molex.com/pdm_docs/ps/PS-87831-027.pdf; ComponentLink1Description: Datasheet
J9 = 0878310641: Manufacturer: Molex; Number of Positions: 6; Current Rating: 2A; Voltage Rating: 125V; Gender: Male; Reviewed: No; Part Number: 0878310641; Manufacturer Part Number: 0878310641; Series: Milli-Grid 87831; Mount: Through Hole; Number of Rows: 2; Fastening Type: Latch Holder; Orientation: Vertical; Min Operating Temperature: -55°C; Max Operating Temperature: 105°C; Supplier 1: Digi-Key; Supplier Part Number 1: WM3590-ND; ComponentLink1URL: https://tools.molex.com/pdm_docs/ps/PS-87831-027.pdf; ComponentLink1Description: Datasheet
O1 = 830058383B: 16 MHz ±30ppm Crystal 20pF 40 Ohms HC-49/US; Manufacturer: Epson; Manufacturer Part Number: TSX-3225 16.0000MF18X-AC0; ESR (Equivalent Series Resistance): 60Ω; Frequency: 16MHz; Frequency Stability: 18ppm; Frequency Tolerance: 0.001%; Load Capacitance: 9pF; Supplier: DigiKey; Supplier Part Number: SER4070CT-ND; RoHS: Compliant; Category: Crystals; Stock: 610; Pricing: 1=0.37, 10=0.324, 25=0.3068, 50=0.294, 100=0.2819, 250=0.26656, 500=0.25552 (USD); Case/Package: SMD/SMT; China RoHS: Compliant; Height: 600µm; Length: 3.2004mm; Lifecycle Status: Production; Max Operating Temperature: 85°C; Min Operating Temperature: -40°C; Mounting Technology: Surface Mount; REACH SVHC: Yes; Schedule B: 8541600080; ESR: 60Ω; Tolerance: 0.001%; Width: 2.4892mm; ComponentLink1URL: https://datasheet.octopart.com:443/TSX-3225-16.0000MF18X-AC0-Epson-datasheet-61114919.pdf?src-supplier=Electro+Sonic; ComponentLink1Description: https://datasheet.octopart.com:443/TSX-3225-16.0000MF18X-AC0-Epson-datasheet-61114919.pdf?src-supplier=Electro+Sonic; ComponentLink2URL: https://datasheet.octopart.com:443/TSX-322516.0000MF18X-AC0-Epson-datasheet-189100294.pdf?src-supplier=Electro+Sonic; ComponentLink2Description: https://datasheet.octopart.com:443/TSX-322516.0000MF18X-AC0-Epson-datasheet-189100294.pdf?src-supplier=Electro+Sonic; ComponentLink3URL: https://datasheet.octopart.com:443/TSX-322516.0000MF18X-AC0-Epson-datasheet-180663999.pdf?src-supplier=IHS; ComponentLink3Description: https://datasheet.octopart.com:443/TSX-322516.0000MF18X-AC0-Epson-datasheet-180663999.pdf?src-supplier=IHS; ComponentLink4URL: https://datasheet.octopart.com:443/TSX-3225-16.0000MF18X-AC0-Epson-datasheet-140567378.pdf?src-supplier=Arrow.cn; ComponentLink4Description: https://datasheet.octopart.com:443/TSX-3225-16.0000MF18X-AC0-Epson-datasheet-140567378.pdf?src-supplier=Arrow.cn; ComponentLink5URL: http://sigma.octopart.com:80/149135495/reach_statement/Epson-TSX-3225-16.0000MF18X-AC0.pdf?src-supplier=Compliance+Statements; ComponentLink5Description: http://sigma.octopart.com:80/149135495/reach_statement/Epson-TSX-3225-16.0000MF18X-AC0.pdf?src-supplier=Compliance+Statements; ComponentLink6URL: http://sigma.octopart.com:80/149135496/rohs_statement/Epson-TSX-3225-16.0000MF18X-AC0.pdf?src-supplier=Compliance+Statements; ComponentLink6Description: http://sigma.octopart.com:80/149135496/rohs_statement/Epson-TSX-3225-16.0000MF18X-AC0.pdf?src-supplier=Compliance+Statements
O2 = AB26T-32.768KHZ-6-B: 32.768 kHz ±20ppm Crystal 6pF 35 kOhms Cylindrical Can, Radial; Manufacturer: Epson; Manufacturer Part Number: TSX-3225 16.0000MF18X-AC0; ESR (Equivalent Series Resistance): 60Ω; Frequency: 16MHz; Frequency Stability: 18ppm; Frequency Tolerance: 0.001%; Load Capacitance: 9pF; Supplier: DigiKey; Supplier Part Number: SER4070CT-ND; RoHS: Compliant; Category: Crystals; Stock: 610; Pricing: 1=0.37, 10=0.324, 25=0.3068, 50=0.294, 100=0.2819, 250=0.26656, 500=0.25552 (USD); Case/Package: SMD/SMT; China RoHS: Compliant; Height: 600µm; Length: 3.2004mm; Lifecycle Status: Production; Max Operating Temperature: 85°C; Min Operating Temperature: -40°C; Mounting Technology: Surface Mount; REACH SVHC: Yes; Schedule B: 8541600080; ESR: 60Ω; Tolerance: 0.001%; Width: 2.4892mm; ComponentLink1URL: https://datasheet.octopart.com:443/TSX-3225-16.0000MF18X-AC0-Epson-datasheet-61114919.pdf?src-supplier=Electro+Sonic; ComponentLink1Description: https://datasheet.octopart.com:443/TSX-3225-16.0000MF18X-AC0-Epson-datasheet-61114919.pdf?src-supplier=Electro+Sonic; ComponentLink2URL: https://datasheet.octopart.com:443/TSX-322516.0000MF18X-AC0-Epson-datasheet-189100294.pdf?src-supplier=Electro+Sonic; ComponentLink2Description: https://datasheet.octopart.com:443/TSX-322516.0000MF18X-AC0-Epson-datasheet-189100294.pdf?src-supplier=Electro+Sonic; ComponentLink3URL: https://datasheet.octopart.com:443/TSX-322516.0000MF18X-AC0-Epson-datasheet-180663999.pdf?src-supplier=IHS; ComponentLink3Description: https://datasheet.octopart.com:443/TSX-322516.0000MF18X-AC0-Epson-datasheet-180663999.pdf?src-supplier=IHS; ComponentLink4URL: https://datasheet.octopart.com:443/TSX-3225-16.0000MF18X-AC0-Epson-datasheet-140567378.pdf?src-supplier=Arrow.cn; ComponentLink4Description: https://datasheet.octopart.com:443/TSX-3225-16.0000MF18X-AC0-Epson-datasheet-140567378.pdf?src-supplier=Arrow.cn; ComponentLink5URL: http://sigma.octopart.com:80/149135495/reach_statement/Epson-TSX-3225-16.0000MF18X-AC0.pdf?src-supplier=Compliance+Statements; ComponentLink5Description: http://sigma.octopart.com:80/149135495/reach_statement/Epson-TSX-3225-16.0000MF18X-AC0.pdf?src-supplier=Compliance+Statements; ComponentLink6URL: http://sigma.octopart.com:80/149135496/rohs_statement/Epson-TSX-3225-16.0000MF18X-AC0.pdf?src-supplier=Compliance+Statements; ComponentLink6Description: http://sigma.octopart.com:80/149135496/rohs_statement/Epson-TSX-3225-16.0000MF18X-AC0.pdf?src-supplier=Compliance+Statements
PUMP1 PUMP2 VALVE = 1PIN_HEADER_TEST: Test Point Hole; Manufacturer: Molex; Manufacturer Part Number: 0878310641; Number of Positions: 6; Current Rating: 2A; Voltage Rating: 125V; Gender: Male; Reviewed: No; Series: Milli-Grid 87831; Mount: Through Hole; Number of Rows: 2; Fastening Type: Latch Holder; Orientation: Vertical; Min Operating Temperature: -55°C; Max Operating Temperature: 105°C; Supplier 1: Digi-Key; Supplier Part Number 1: WM3590-ND; ComponentLink1URL: https://tools.molex.com/pdm_docs/ps/PS-87831-027.pdf; ComponentLink1Description: Datasheet
Q1-Q3 = SI2300-TP: Manufacturer: MCC (Micro Commercial Components); Number of Positions: 6; Current Rating: 2A; Voltage Rating: 125V; Gender: Male; Reviewed: No; Part Number: SI2300-TP; Manufacturer Part Number: SI2300-TP; Series: -; Number of Rows: 2; Fastening Type: Latch Holder; Orientation: Vertical; Min Operating Temperature: -55°C; Max Operating Temperature: 105°C; Supplier 1: Digi-Key; Supplier Part Number 1: WM3590-ND; ComponentLink1URL: https://tools.molex.com/pdm_docs/ps/PS-87831-027.pdf; ComponentLink1Description: Datasheet
R1-R21 = RESISTOR: Voltage Rating: 75V; Voltage Rating (DC): 50V; Resistance Tolerance: 1%; Resistance: 10kR; Power Rating: 100mW; Temperature Coefficient: 100ppm/°C; Depth: 0.8mm; Termination: SMD/SMT; Resistor Type: Thick Film; Series: RC; Construction: Rectangular; Features: Moisture Resistant; Packaging: Tape and Reel; Min Operating Temperature: -55°C; Number of Terminations: 2; Lead Pitch: 0.3mm; RoHS Compliant: Yes; Case/Package: 0603; Military Standard: Not; Weight: 7.1E-05oz; Number of Pins: 2; Tolerance: 1%; Length: 1.6mm; Case Code (Imperial): 0603; Lead Free: Lead Free; Width: 0.8mm; Max Power Dissipation: 100mW; Height: 0.45mm; Max Operating Temperature: 155°C; Case Code (Metric): 1608; Size Code: 0603
SW1 = SPST Push Button: Switch Tactile N.O. SPST Round Button Gull Wing 0.05A 12VDC 1.5N SMD Embossed T/R; Manufacturer: Omron; Manufacturer Part Number: B3U-1100PM; Actuator Length: 400µm; Connector Type: SMD/SMT; Contact Current Rating: 50mA; Contact Resistance: 100mΩ; Electrical Life: 200kcycles; Illumination Type: Illuminated, Non-Illuminated; Max Voltage Rating (DC): 12V; Number of Positions: 1; Ratings: Dust Proof; Sealable: IP40; Switch Function: Off-Mom; Switch Travel: 150µm; Supplier: DigiKey; Supplier Part Number: SW1451CT-ND; RoHS: Compliant; Category: Tactile Switches; Stock: 1875; Pricing: 1=0.77, 10=0.77 (USD); Ambient Temperature Range High: 70°C; Case/Package: SMD/SMT; Color: Black; Contact Plating: Silver; Current Rating: 50mA; Height: 1.2mm; Insulation Resistance: 100MΩ; Length: 3mm; Life (Cycles): 200kcycles; Lifecycle Status: Production; Max Operating Temperature: 70°C; Mechanical Life: 200kcycles; Min Operating Temperature: -25°C; Mounting Technology: Surface Mount; Operating Force: 1.5N; Orientation: Straight; Packaging: Digi-Reel®; REACH SVHC: No; Termination: SMD/SMT; Throw Configuration: SPST; Voltage Rating (DC): 12V; Weight: 22mg; ComponentLink1URL: https://datasheet.octopart.com:443/B3U-1100PM-Omron-datasheet-62106914.pdf?src-supplier=IHS; ComponentLink1Description: https://datasheet.octopart.com:443/B3U-1100PM-Omron-datasheet-62106914.pdf?src-supplier=IHS; ComponentLink2URL: https://datasheet.octopart.com:443/B3U-1100PM-Omron-datasheet-10910421.pdf?src-supplier=Omron; ComponentLink2Description: https://datasheet.octopart.com:443/B3U-1100PM-Omron-datasheet-10910421.pdf?src-supplier=Omron; ComponentLink3URL: https://datasheet.octopart.com:443/B3U-1100PM-Omron-datasheet-17589256.pdf?src-supplier=Farnell; ComponentLink3Description: https://datasheet.octopart.com:443/B3U-1100PM-Omron-datasheet-17589256.pdf?src-supplier=Farnell; ComponentLink4URL: https://datasheet.octopart.com:443/B3U-1100PM-Omron-datasheet-5458533.pdf?src-supplier=Sager+Electronics; ComponentLink4Description: https://datasheet.octopart.com:443/B3U-1100PM-Omron-datasheet-5458533.pdf?src-supplier=Sager+Electronics; ComponentLink5URL: https://datasheet.octopart.com:443/B3U-1100PM-Omron-datasheet-110759174.pdf?src-supplier=Newark; ComponentLink5Description: https://datasheet.octopart.com:443/B3U-1100PM-Omron-datasheet-110759174.pdf?src-supplier=Newark; ComponentLink6URL: https://datasheet.octopart.com:443/B3U-1100PM-Omron-datasheet-156114341.pdf?src-supplier=TME; ComponentLink6Description: https://datasheet.octopart.com:443/B3U-1100PM-Omron-datasheet-156114341.pdf?src-supplier=TME
SW2 = DPST Switch